# EAGLE design Fluke_PM9080_USB (EAGLE 4.13)
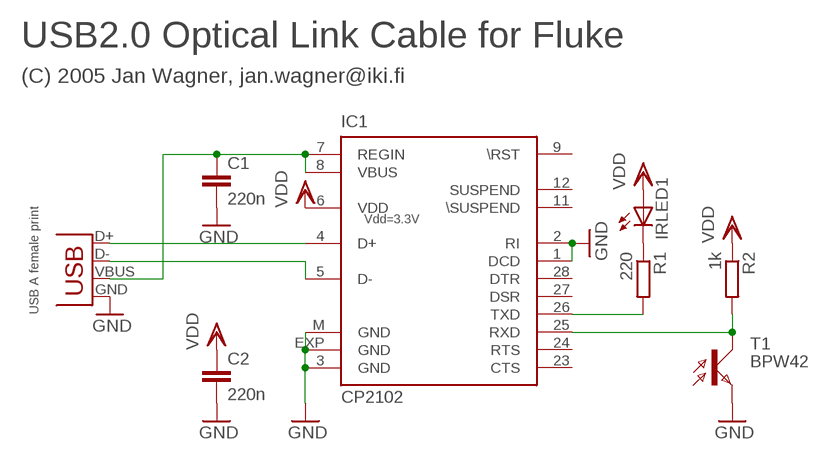
[diagram p0: schematic, sheet 1]

## Parts
C1  220n  C-EUC1206  [C1206]
C2  220n  C-EUC1206  [C1206]
IC1  CP2102  [MLP28]
IRLED1  LED3MM  [LED3MM]
R1  220  R-EU_M0805  [M0805]
R2  1k  R-EU_M0805  [M0805]
T1  BPW42  BPX81  [BPX81]
X2  USB-A-H  [USB-A-H]

## Nets
GND: C1.2 C2.2 IC1.1(DCD) IC1.2(RI) IC1.3(GND) IC1.EXP(GND) IC1.M(GND) T1.E X2.GND
N$1: IC1.4(D+) X2.D+
N$2: IC1.5(D-) X2.D-
N$4: IRLED1.K(C) R1.1
N$5: IC1.25(RXD) R2.2 T1.C
N$6: IC1.26(TXD) R1.2
VBUS: C1.1 IC1.7(REGIN) IC1.8(VBUS) X2.VBUS
VDD: C2.1 IC1.6(VDD) IRLED1.A R2.1
Unconnected: IC1.9(\RST) IC1.11(\SUSPEND) IC1.12(SUSPEND) IC1.23(CTS) IC1.24(RTS) IC1.27(DSR) IC1.28(DTR)

## Notes on the sheet
- USB2.0 Optical Link Cable for Fluke
- (C) 2005 Jan Wagner, jan.wagner@iki.fi
- Vdd=3.3V
- USB A female print

## Library data of the parts
C1 C2 = rcl:C-EU: CAPACITOR, European symbol
IC1 = silabs:CP210*: Single-Chip USB to UART Bridge Source: www.silabs.com .. CP2101.pdf / cp2102.pdf
IRLED1 = led:LED: LED OSRAM: - CHIPLED LG R971, LG N971, LY N971, LG Q971, LY Q971, LO R971, LY R971 LH N974, LH R974 LS Q976, LO Q976, LY Q976 LO Q996 - Hyper CHIPLED LW Q18S LB Q993, LB Q99A, LB R99A - SideLED LS A670, LO A670, LY A670, LG A670, LP A670 LB A673, LV A673, LT A673, LW A673 LH A674 LY A675 LS A676, LA A676, LO A676, LY A676, LW A676 LS A679, LY A679, LG A679 - Hyper Micro SIDELED® LS Y876, LA Y876, LO Y876, LY Y876 LT Y87S - SmartLED LW L88C, LW L88S LB L89C, LB L89S, LG L890 LS L89K, LO L89K, LY L89K LS L896, LA L896, LO L896, LY L896 - TOPLED LS T670, LO T670, LY T670, LG T670, LP T670 LSG T670, LSP T670, LSY T670, LOP T670, LYG T670 LG T671, LOG T671, LSG T671 LB T673, LV T673, LT T673, LW T673 LH T674 LS T676, LA T676, LO T676, LY T676, LB T676, LH T676, LSB T676, LW T676 LB T67C, LV T67C, LT T67C, LS T67K, LO T67K, LY T67K, LW E67C LS E67B, LA E67B, LO E67B, LY E67B, LB E67C, LV E67C, LT E67C LW T67C LS T679, LY T679, LG T679 LS T770, LO T770, LY T770, LG T770, LP T770 LB T773, LV T773, LT T773, LW T773 LH T774 LS E675, LA E675, LY E675, LS T675 LS T776, LA T776, LO T776, LY T776, LB T776 LHGB T686 LT T68C, LB T68C - Hyper Mini TOPLED® LB M676 - Mini TOPLED Santana® LG M470 LS M47K, LO M47K, LY M47K Source: http://www.osram.convergy.de/
R1 R2 = rcl:R-EU_: RESISTOR, European symbol
T1 = opto-trans-siemens:BPX81: PHOTO TRANSISTOR
X2 = con-usb:USB: USB Connectors

## Board
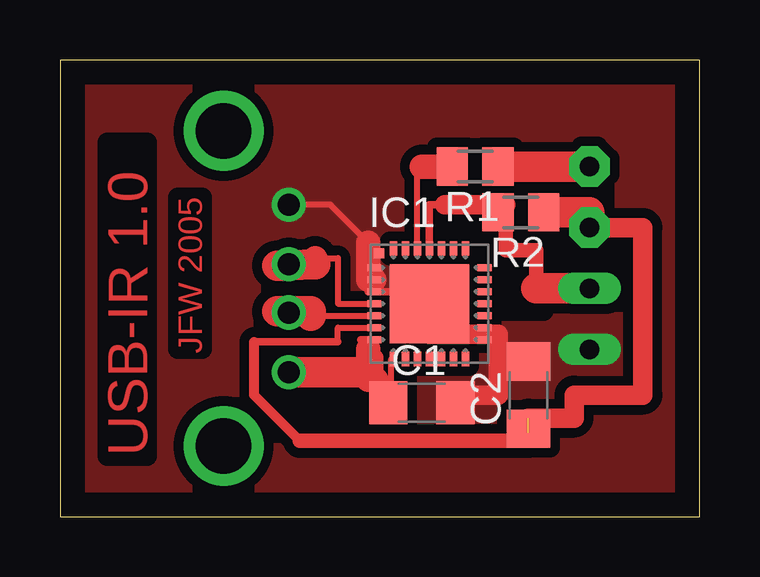
[diagram p1: board, top side]
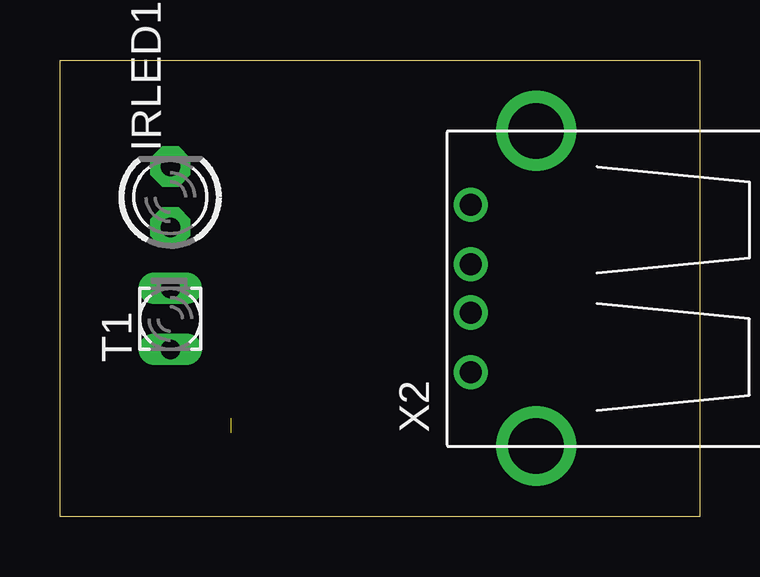
[diagram p2: board, bottom side, seen from below]

Size 26.66 x 19.04 mm. Coordinates in mm from the lower left corner, seen from the top.
Outline: 0,0 26.66,0 26.66,19.04 0,19.04 0,0
Copper layers (1*16): Top 0.035mm / dielectric 1.5mm / Bottom 0.035mm
Design rules "default": minimum track width 10mil, minimum drill 24mil, track to track 8mil, track to pad 8mil, pad to pad 8mil, via to via 8mil, smd to smd 8mil, copper to edge 40mil, drill to drill 8mil, minimum pad ring 10mil, minimum via ring 8mil, stop-mask expansion 4mil, vias tented up to drill 0mil, thermal gap 10mil
tRestrict: area 17,8.6 to 20.2,11.7; area 21.4,12.7 to 22.7,14

### Footprints (pad centres in the part's own frame; a part is rotated, then mirrored left to right if it is on the bottom)
C1206 = smd 1.6 x 1.8: 1 -1.4,0; 2 1.4,0
MLP28 = smd 0.6 x 0.3: 1 -2.3,1.5; 2 -2.3,1; 3 -2.3,0.5; 4 -2.3,0; 5 -2.3,-0.5; 6 -2.3,-1; 7 -2.3,-1.5; 15 2.3,-1.5; 16 2.3,-1; 17 2.3,-0.5; 18 2.3,0; 19 2.3,0.5; 20 2.3,1; 21 2.3,1.5 | smd 0.3 x 0.6: 8 -1.5,-2.3; 9 -1,-2.3; 10 -0.5,-2.3; 11 0,-2.3; 12 0.5,-2.3; 13 1,-2.3; 14 1.5,-2.3; 22 1.5,2.3; 23 1,2.3; 24 0.5,2.3; 25 0,2.3; 26 -0.5,2.3; 27 -1,2.3; 28 -1.5,2.3 | smd 3.3 x 3.3: EXP 0,0 | smd 0.435 x 0.435: M -2.103,2.103
LED3MM = drill 0.813 pad 1.676 octagon: A -1.27,0; K 1.27,0
M0805 = smd 1.3 x 1.6: 1 -0.95,0; 2 0.95,0
BPX81 = drill 0.813 long: C 1.27,0; E -1.27,0
USB-A-H = drill 0.914 round: D+ 2.718,-1.003; D- 2.718,1.003; GND 2.718,-3.493; VBUS 2.718,3.493 | drill 2.311 round: P$5 0,-6.566; P$6 0,6.566

### Placement (x,y rotation side)
C1  15.08,4.76 0 top
C2  19.52,5.08 90 top
IC1  15.39,8.88 0 top
IRLED1  22.06,13.33 90 bottom
R1  17.3,14.6 180 top
R2  19.2,12.7 180 top
T1  22.06,8.25 90 bottom
X2  6.82,9.52 180 bottom

### Tracks (layer width: path | path; a pad name or v marks a point on that pad's centre or on a via)
GND
  Top 0.254: 13.17,11.11 12.85,11.42 11.27,13.01 X2.GND
  Top 0.305: IC1.M 13.17,11.11 12.85,10.79 12.85,9.38 IC1.3 15.39,9.38 IC1.EXP
  Top 0.813: C1.2 16.47,5.08 18.25,5.08 18.25,7.62 15.39,7.62 IC1.EXP
  Top 1.016: IC1.2 12.85,9.88 12.85,10.79 12.85,11.42
  pour Top (isolate 0.406, no thermals): 1.1,19.04 1.1,-0.01 26.82,-0.01 26.82,19.04
N$1
  Top 0.254: IC1.4 11.58,8.88 11.58,10.79 10.63,10.79
  Top 1.016: 10.63,10.52 10.63,10.79
  Top 1.27: X2.D+ 9.54,10.47 9.04,10.47 10.63,10.52
N$2
  Top 0.254: 10.45,8.38 IC1.5
  Top 1.27: 9.54,8.57 9.36,8.57 | X2.D- 9.54,8.57 | 10.45,8.38 10.45,8.57 9.54,8.57 | 9.54,8.57 9.04,8.57
N$4
  Top 1.27: R1.1 IRLED1.K
N$5
  Top 0.254: R2.2 18.25,13.01 18.57,13.01
  Top 0.305: IC1.25 15.39,13.01 16.03,13.01
  Top 0.61: 18.57,13.01 18.57,11.11 19.84,11.11 19.84,9.52
  Top 0.813: 16.03,13.01 18.57,13.01
  Top 1.27: 19.84,9.52 T1.C
N$6
  Top 0.254: IC1.26 14.89,14.6 15.08,14.6
  Top 1.016: 15.08,14.6 R1.2
VBUS
  Top 0.254: C1.1 13.81,4.76 13.81,6.58 IC1.8
  Top 0.305: C1.1 14.12,4.44 | 13.17,6.58 12.85,6.58 12.85,6.98 12.54,7.39 IC1.7
  Top 0.61: 13.17,6.66 13.17,6.58 13.17,5.71 13.17,4.95 C1.1
  Top 1.016: 12.85,6.98 12.85,6.35 | 13.17,5.71 12.85,5.71 12.85,6.03
  Top 1.27: X2.VBUS 12.85,6.03
VDD  (2 unrouted)
  Top 0.254: IC1.6 11.58,7.89 11.58,7.3
  Top 0.305: 8.09,7.3 11.58,7.3
  Top 0.406: 8.09,7.3 8.09,5.08 10,3.17
  Top 0.61: 19.52,3.51 19.2,3.19 19.52,3.17 10,3.17
  Top 0.813: 22.06,12.7 IRLED1.A 24.28,12.06 24.28,5.08 21.42,5.08 21.42,4.12 19.52,4.12
  Top 1.27: 22.06,12.7 R2.1

### Text on the board
Top: JFW 2005 | USB-IR 1.0